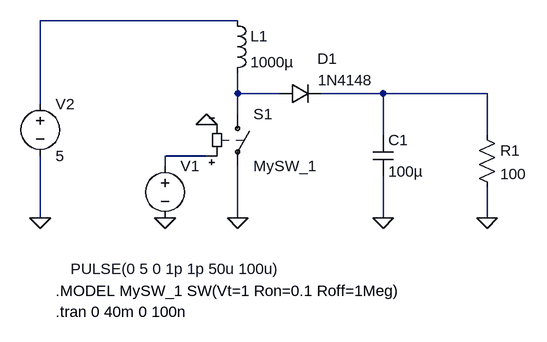
[diagram p0: schematic Switch_Example_3.asc]
Switch_Example_3.asc, the LTspice schematic file:
Version 4
SHEET 1 1504 680
WIRE -144 16 -448 16
WIRE -144 128 -144 96
WIRE -80 128 -144 128
WIRE 80 128 -16 128
WIRE 240 128 80 128
WIRE -448 144 -448 16
WIRE -144 160 -144 128
WIRE 80 192 80 128
WIRE 240 192 240 128
WIRE -192 224 -256 224
WIRE -256 240 -256 224
WIRE -448 320 -448 224
WIRE -144 320 -144 240
WIRE 80 320 80 256
WIRE 240 320 240 272
FLAG -256 320 0
FLAG -192 176 0
FLAG -144 320 0
FLAG -448 320 0
FLAG 80 320 0
FLAG 240 320 0
SYMBOL sw -144 144 R0
SYMATTR InstName S1
SYMATTR Value MySW_1
SYMBOL voltage -256 224 R0
WINDOW 3 179 174 Right 2
WINDOW 123 0 0 Left 0
WINDOW 39 0 0 Left 0
SYMATTR Value PULSE(0 5 0 1p 1p 50u 100u)
SYMATTR InstName V1
SYMBOL voltage -448 128 R0
WINDOW 123 0 0 Left 0
WINDOW 39 0 0 Left 0
SYMATTR InstName V2
SYMATTR Value 5
SYMBOL ind -160 0 R0
SYMATTR InstName L1
SYMATTR Value 1000µ
SYMATTR SpiceLine Rser=0.1
SYMBOL diode -80 144 R270
WINDOW 0 54 74 VTop 2
WINDOW 3 52 102 VBottom 2
SYMATTR InstName D1
SYMATTR Value 1N4148
SYMBOL cap 64 192 R0
SYMATTR InstName C1
SYMATTR Value 100µ
SYMBOL res 224 176 R0
SYMATTR InstName R1
SYMATTR Value 100
TEXT -424 464 Left 2 !.tran 0 40m 0 100n
TEXT -424 432 Left 2 !.MODEL MySW_1 SW(Vt=1 Ron=0.1 Roff=1Meg)

The netlist it stands for:
* Switch_Example_3.asc
S1 N002 0 N004 0 MySW_1
V1 N004 0 PULSE(0 5 0 1p 1p 50u 100u)
V2 N001 0 5
L1 N001 N002 1000µ Rser=0.1
D1 N002 N003 1N4148
C1 N003 0 100µ
R1 N003 0 100
.model D D
.lib standard.dio
.tran 0 40m 0 100n
.MODEL MySW_1 SW(Vt=1 Ron=0.1 Roff=1Meg)
.backanno
.end